# EAGLE design mega_shield3 (EAGLE 7.6.0)
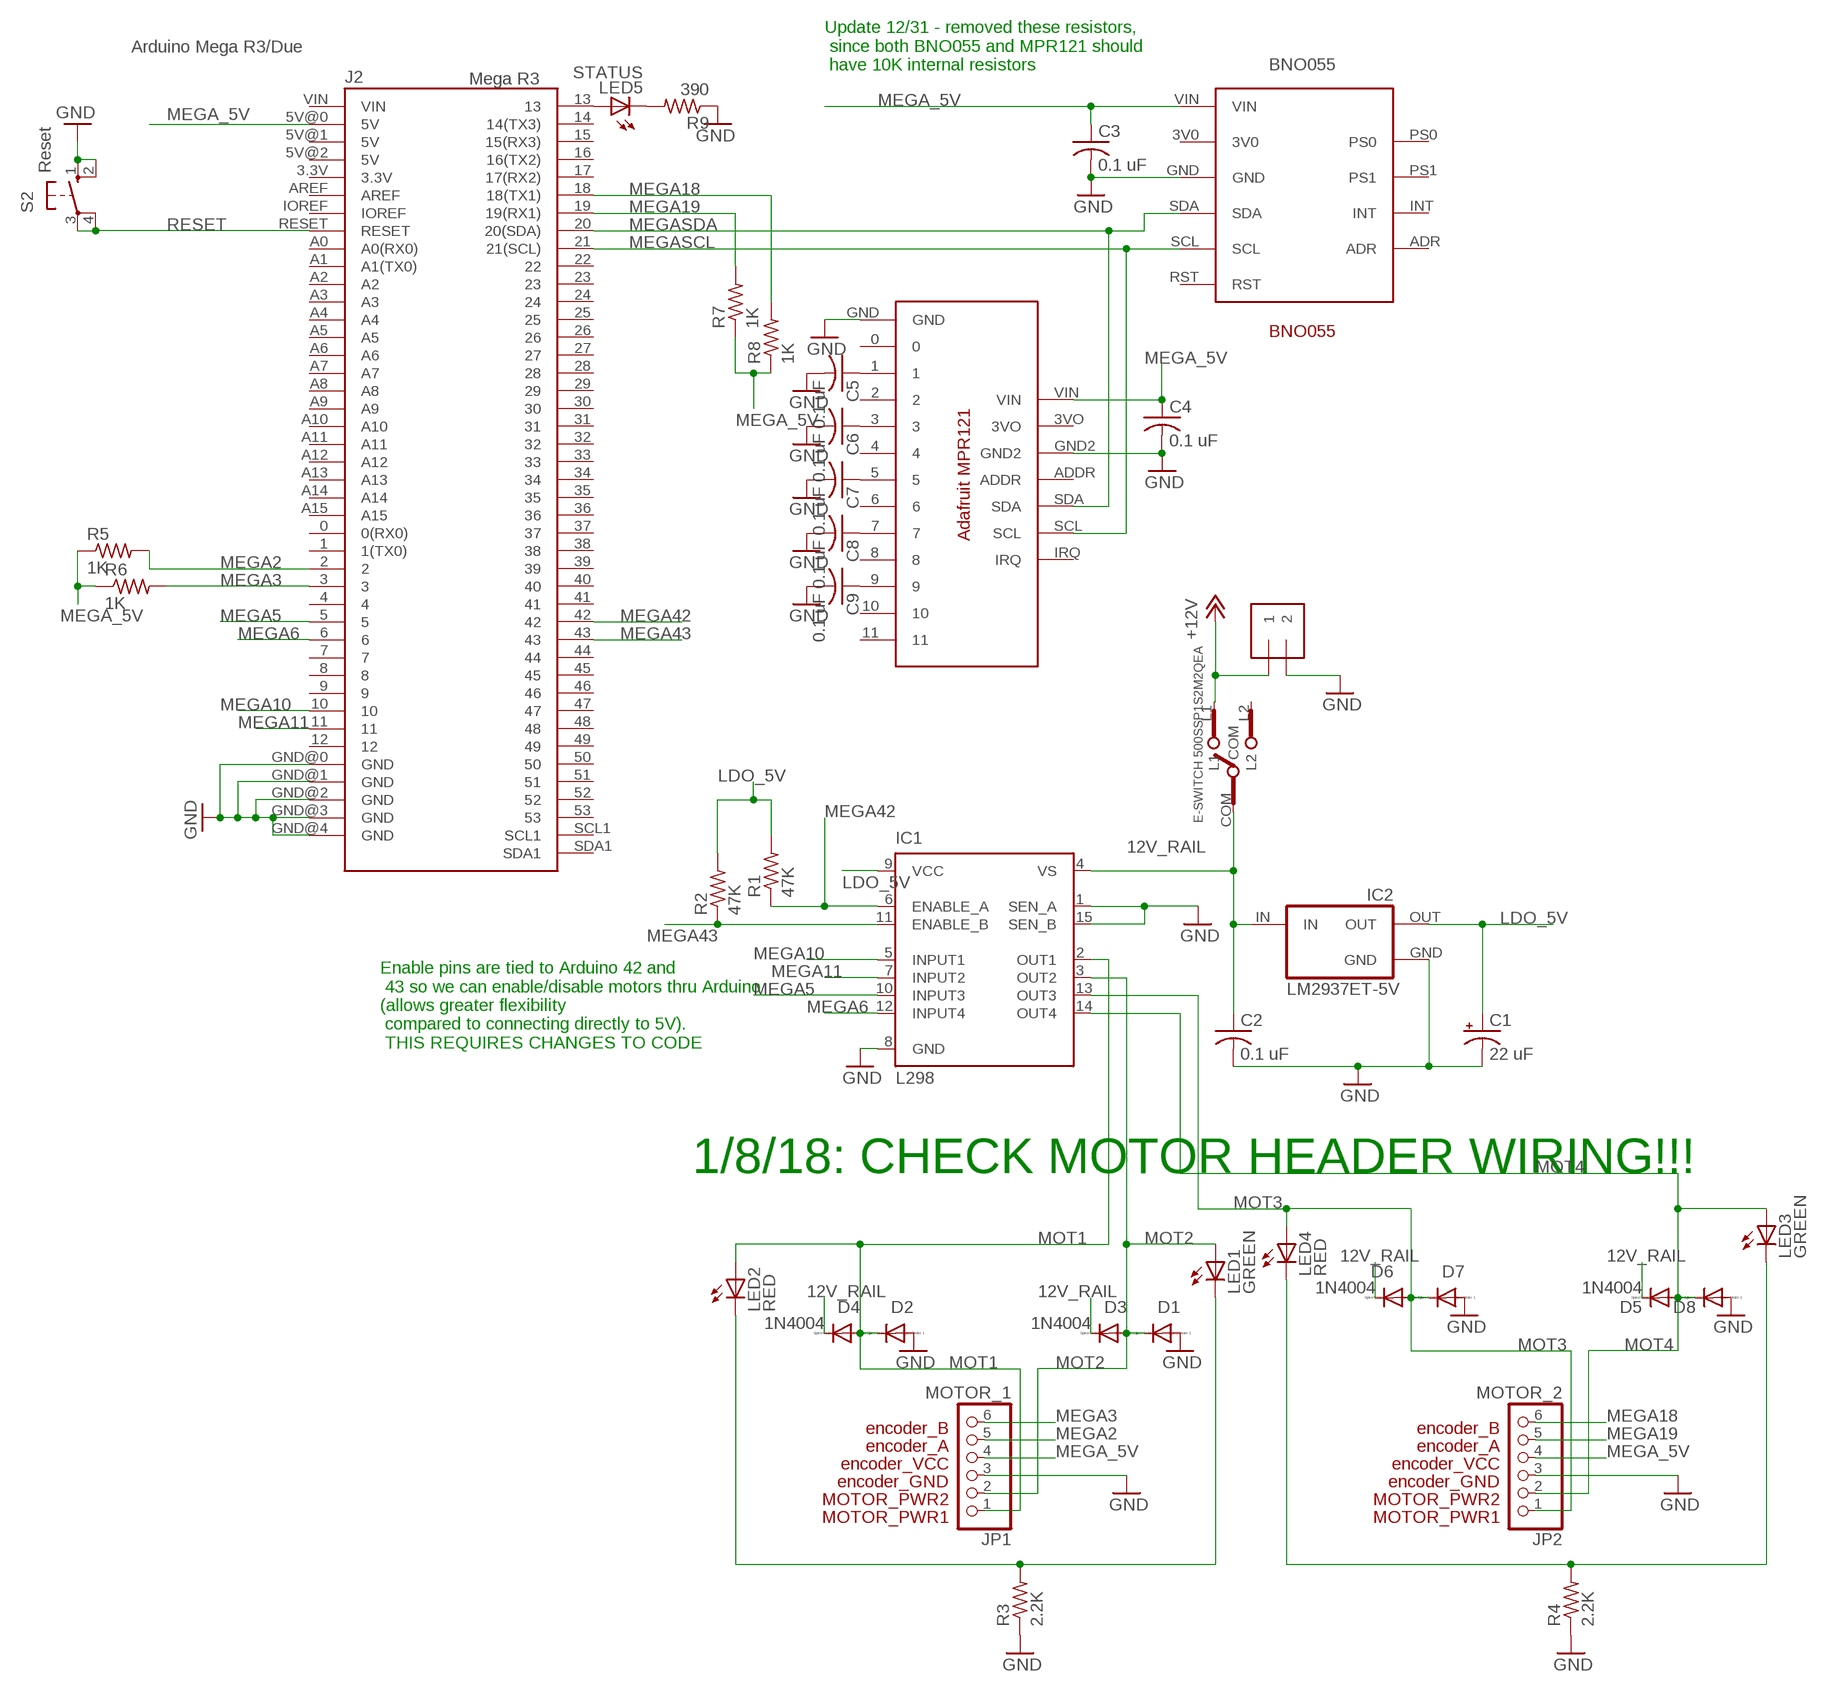
[diagram p0: schematic, sheet 1]

## Parts
12V_IN  1X2-3.5MM  [1X2-3.5MM]
BNO055  BNO055  [BNO055]
C1  22 uF  CPOL-USB45181A  [B45181A]
C2  0.1 uF  C-US025-050X050  [C025-050X050]
C3  0.1 uF  C-US025-050X050  [C025-050X050]
C4  0.1 uF  C-US025-050X050  [C025-050X050]
C5  0.1 uF  C-US025-050X050  [C025-050X050]
C6  0.1 uF  C-US025-050X050  [C025-050X050]
C7  0.1 uF  C-US025-050X050  [C025-050X050]
C8  0.1 uF  C-US025-050X050  [C025-050X050]
C9  0.1 uF  C-US025-050X050  [C025-050X050]
D1  1N4004  [DO41-10]
D2  1N4004  [DO41-10]
D3  1N4004  [DO41-10]
D4  1N4004  [DO41-10]
D5  1N4004  [DO41-10]
D6  1N4004  [DO41-10]
D7  1N4004  [DO41-10]
D8  1N4004  [DO41-10]
IC1  L298  [MULTIWATT-15]
IC2  LM2937ET-5V  LM2937ET-5,0  [TO220(V)]
J2  Mega R3  ARDUINO-MEGAFULL  [ARDUINO_MEGA]
JP1  MOTOR_1  PINHD-1X6  [1X06]
JP2  MOTOR_2  PINHD-1X6  [1X06]
LED1  GREEN  LED3MM  [LED3MM]
LED2  RED  LED3MM  [LED3MM]
LED3  GREEN  LED3MM  [LED3MM]
LED4  RED  LED3MM  [LED3MM]
LED5  STATUS  LED3MM  [LED3MM]
MPR121  ADA_MPR121  [ADA_MPR121]
R1  47K  R-US_0207/10  [0207/10]
R2  47K  R-US_0207/10  [0207/10]
R3  2.2K  R-US_0207/10  [0207/10]
R4  2.2K  R-US_0207/10  [0207/10]
R5  1K  R-US_0207/10  [0207/10]
R6  1K  R-US_0207/10  [0207/10]
R7  1K  R-US_0207/10  [0207/10]
R8  1K  R-US_0207/10  [0207/10]
R9  390  R-US_0207/10  [0207/10]
S2  Reset  10-XX  [B3F-10XX]
SLIDE_SW  E-SWITCH_500SSP1S2M2QEA  [E-SWITCH_500SSP1S2M2QEA]

## Nets
12V_RAIL [12V_PWR]: C2.1 D3.C D4.C D5.C D6.C IC1.4(VS) IC2.IN SLIDE_SW.COM
+12V [12V_PWR]: 12V_IN.1 SLIDE_SW.L1
GND: 12V_IN.2 BNO055.GND C1.- C2.2 C3.2 C4.2 C5.2 C6.2 C7.2 C8.2 C9.2 D1.A D2.A D7.A D8.A IC1.1(SEN_A) IC1.8(GND) IC1.15(SEN_B) IC2.GND J2.GND@0(GND) J2.GND@1(GND) J2.GND@2(GND) J2.GND@3(GND) J2.GND@4(GND) JP1.3 JP2.3 MPR121.GND MPR121.GND2 R3.1 R4.1 R9.1 S2.1(S) S2.2(S1)
LDO_5V [5V_LDO]: C1.+ IC1.9(VCC) IC2.OUT R1.2 R2.2
MEGA2: J2.2 JP1.5 R5.2
MEGA3: J2.3 JP1.6 R6.2
MEGA5: IC1.10(INPUT3) J2.5
MEGA6: IC1.12(INPUT4) J2.6
MEGA10: IC1.5(INPUT1) J2.10
MEGA11: IC1.7(INPUT2) J2.11
MEGA18: J2.18(18(TX1)) JP2.6 R8.2
MEGA19: J2.19(19(RX1)) JP2.5 R7.2
MEGA42: IC1.6(ENABLE_A) J2.42 R1.1
MEGA43: IC1.11(ENABLE_B) J2.43 R2.1
MEGA_5V [5V_LDO]: BNO055.VIN C3.1 C4.1 J2.5V@0(5V) JP1.4 JP2.4 MPR121.VIN R5.1 R6.1 R7.1 R8.1
MEGASCL: BNO055.SCL J2.21(21(SCL)) MPR121.SCL
MEGASDA: BNO055.SDA J2.20(20(SDA)) MPR121.SDA
MOT1 [12V_PWR]: D2.C D4.A IC1.2(OUT1) JP1.1 LED2.A
MOT2 [12V_PWR]: D1.C D3.A IC1.3(OUT2) JP1.2 LED1.A
MOT3 [12V_PWR]: D6.A D7.C IC1.13(OUT3) JP2.1 LED4.A
MOT4 [12V_PWR]: D5.A D8.C IC1.14(OUT4) JP2.2 LED3.A
N$1: C5.1 MPR121.1
N$2: C6.1 MPR121.3
N$3: J2.13 LED5.A
N$4: LED5.K(C) R9.2
N$5: C7.1 MPR121.5
N$6: C8.1 MPR121.7
N$7: LED1.K(C) LED2.K(C) R3.2
N$8: C9.1 MPR121.9
N$12: LED3.K(C) LED4.K(C) R4.2
RESET: J2.RESET S2.3(P) S2.4(P1)
Unconnected: BNO055.3V0 BNO055.ADR BNO055.INT BNO055.PS0 BNO055.PS1 BNO055.RST J2.0(0(RX0)) J2.1(1(TX0)) J2.3.3V J2.4 J2.5V@1(5V) J2.5V@2(5V) J2.7 J2.8 J2.9 J2.12 J2.14(14(TX3)) J2.15(15(RX3)) J2.16(16(TX2)) J2.17(17(RX2)) J2.22 J2.23 J2.24 J2.25 J2.26 J2.27 J2.28 J2.29 J2.30 J2.31 J2.32 J2.33 J2.34 J2.35 J2.36 J2.37 J2.38 J2.39 J2.40 J2.41 J2.44 J2.45 J2.46 J2.47 J2.48 J2.49 J2.50 J2.51 J2.52 J2.53 J2.A0(A0(RX0)) J2.A1(A1(TX0)) J2.A2 J2.A3 J2.A4 J2.A5 J2.A6 J2.A7 J2.A8 J2.A9 J2.A10 J2.A11 J2.A12 J2.A13 J2.A14 J2.A15 J2.AREF J2.IOREF J2.SCL1 J2.SDA1 J2.VIN MPR121.0 MPR121.2 MPR121.3VO MPR121.4 MPR121.6 MPR121.8 MPR121.10 MPR121.11 MPR121.ADDR MPR121.IRQ SLIDE_SW.L2

## Notes on the sheet
- Arduino Mega R3/Due
- Update 12/31 - removed these resistors,
   since both BNO055 and MPR121 should
   have 10K internal resistors
- Enable pins are tied to Arduino 42 and
   43 so we can enable/disable motors thru Arduino 
  (allows greater flexibility
   compared to connecting directly to 5V).
   THIS REQUIRES CHANGES TO CODE
- 1/8/18: CHECK MOTOR HEADER WIRING!!!

## Library data of the parts
12V_IN = adafruit:1X2: 3.5mm Terminal block http://www.ladyada.net/library/pcb/eaglelibrary.html
BNO055 = arduinoShield:BNO055
C1 = rcl:CPOL-US: POLARIZED CAPACITOR, American symbol
C2-C9 = rcl:C-US: CAPACITOR, American symbol
D1-D8 = diode:1N4004: DIODE general purpose rectifier, 1 A
IC1 = st-microelectronics:L298: DUAL FULL-BRIDGE DRIVER; MPN: L298N; OC_FARNELL: 1589425; OC_NEWARK: 32M1527
IC2 = lm2937:LM2937ET*: 400 and 500 mA Low Dropout Voltage Regulator NATIONAL SEMICONDUCTOR created by Peter.Hofmann@ph-tronic.de <mailto:Reter.Hofmann@ph-tronic.de> 10-2004 Rev.0
J2 = zortness:ARDUINO-MEGA: Arduino MegaR3 board footprint. Also works for Due.
JP1 JP2 = adafruit:PINHD-1X6: PIN HEADER
LED1-LED5 = adafruit:LED: LED OSRAM: - CHIPLED LG R971, LG N971, LY N971, LG Q971, LY Q971, LO R971, LY R971 LH N974, LH R974 LS Q976, LO Q976, LY Q976 LO Q996 - Hyper CHIPLED LW Q18S LB Q993, LB Q99A, LB R99A - SideLED LS A670, LO A670, LY A670, LG A670, LP A670 LB A673, LV A673, LT A673, LW A673 LH A674 LY A675 LS A676, LA A676, LO A676, LY A676, LW A676 LS A679, LY A679, LG A679 - Hyper Micro SIDELED® LS Y876, LA Y876, LO Y876, LY Y876 LT Y87S - SmartLED LW L88C, LW L88S LB L89C, LB L89S, LG L890 LS L89K, LO L89K, LY L89K LS L896, LA L896, LO L896, LY L896 - TOPLED LS T670, LO T670, LY T670, LG T670, LP T670 LSG T670, LSP T670, LSY T670, LOP T670, LYG T670 LG T671, LOG T671, LSG T671 LB T673, LV T673, LT T673, LW T673 LH T674 LS T676, LA T676, LO T676, LY T676, LB T676, LH T676, LSB T676, LW T676 LB T67C, LV T67C, LT T67C, LS T67K, LO T67K, LY T67K, LW E67C LS E67B, LA E67B, LO E67B, LY E67B, LB E67C, LV E67C, LT E67C LW T67C LS T679, LY T679, LG T679 LS T770, LO T770, LY T770, LG T770, LP T770 LB T773, LV T773, LT T773, LW T773 LH T774 LS E675, LA E675, LY E675, LS T675 LS T776, LA T776, LO T776, LY T776, LB T776 LHGB T686 LT T68C, LB T68C - Hyper Mini TOPLED® LB M676 - Mini TOPLED Santana® LG M470 LS M47K, LO M47K, LY M47K Source: http://www.osram.convergy.de/
MPR121 = arduinoShield:ADA_MPR121
R1-R9 = rcl:R-US_: RESISTOR, American symbol
S2 = switch-omron:10-XX: OMRON SWITCH; MPN: B3F-1000; OC_FARNELL: 176432; OC_NEWARK: 36M3542
SLIDE_SW = arduinoShield:E-SWITCH_500SSP1S2M2QEA

## Net classes
1 12V_PWR: width 2.159 mm
2 5V_LDO: width 0.305 mm

## Board
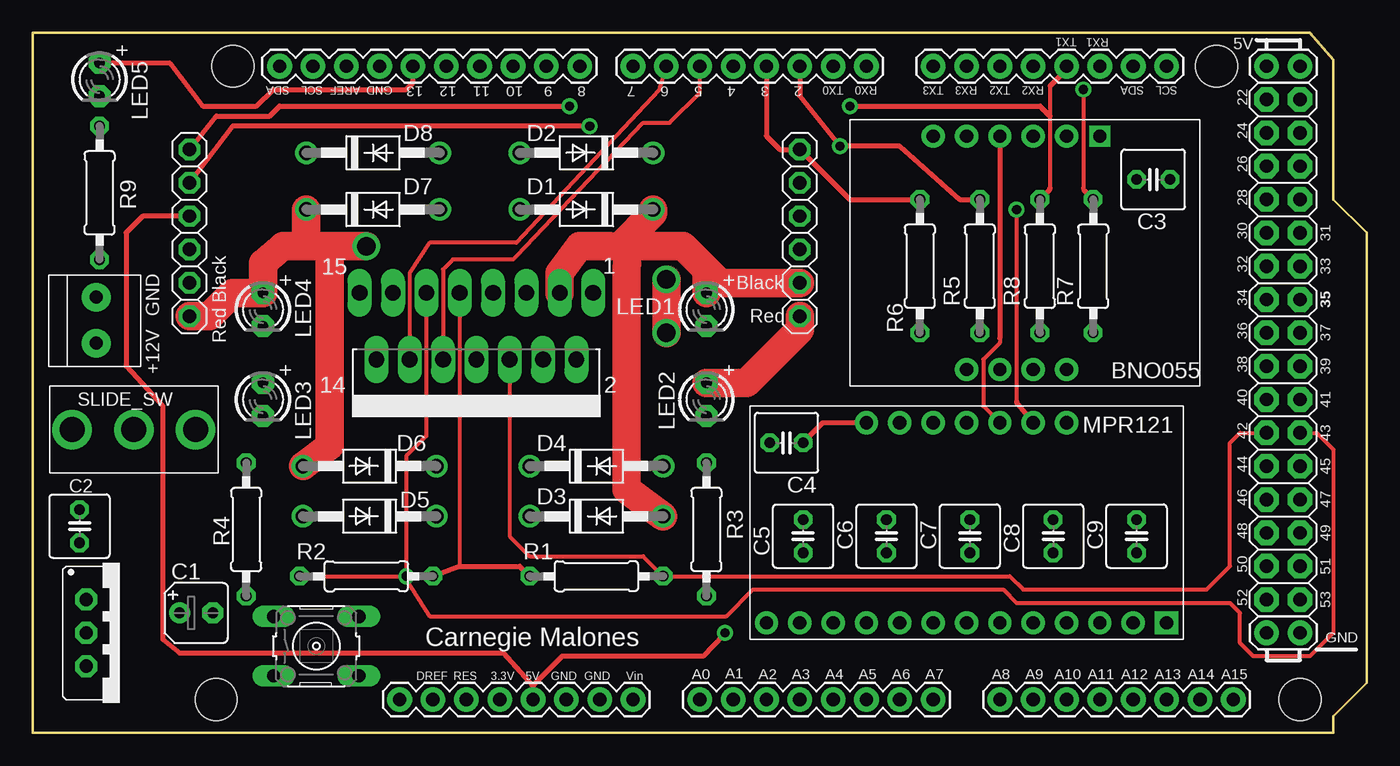
[diagram p1: board, top side]
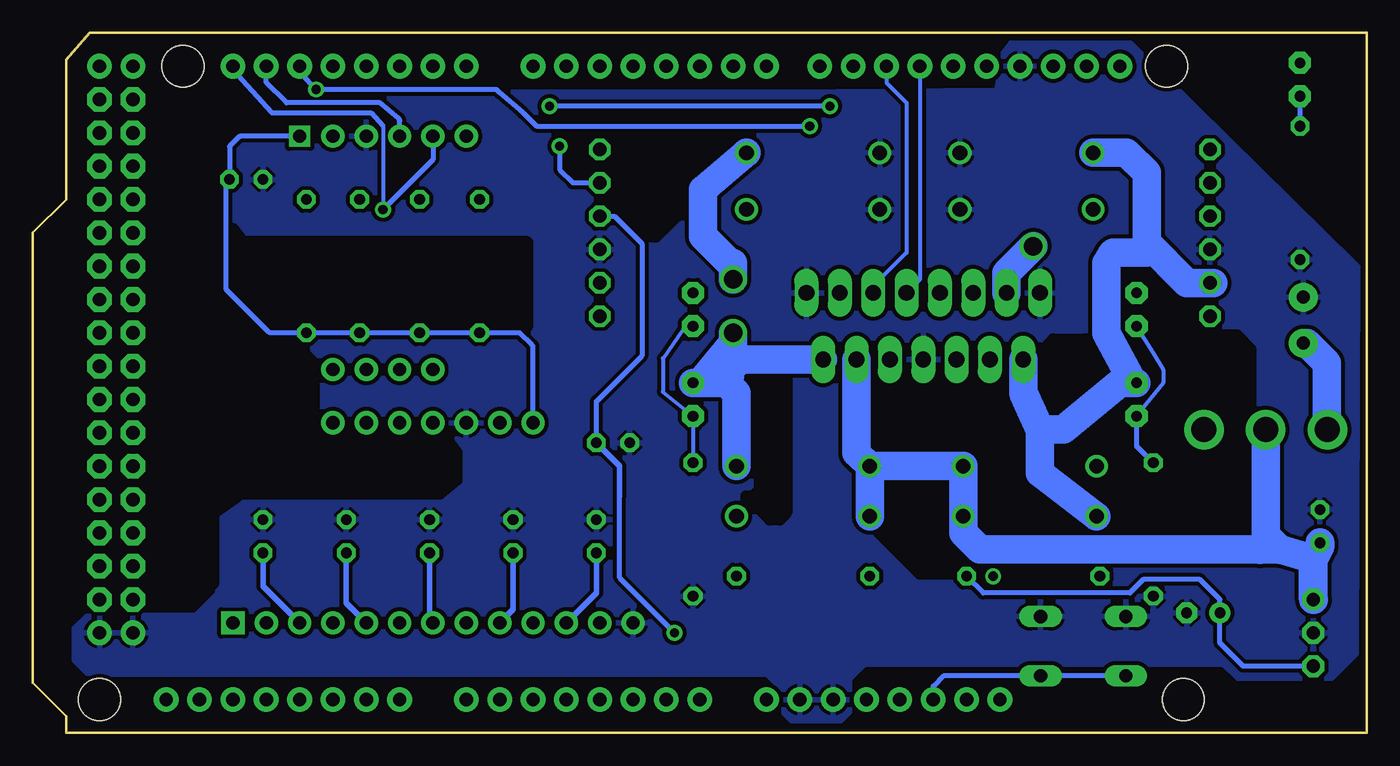
[diagram p2: board, bottom side, seen from below]

Size 101.6 x 53.34 mm. Coordinates in mm from the lower left corner, seen from the top.
Copper layers (1*16): Top 0.035mm / dielectric 1.5mm / Bottom 0.035mm
Design rules "SparkFun": minimum track width 8mil, minimum drill 20mil, track to track 8mil, track to pad 8mil, pad to pad 8mil, via to via 8mil, smd to smd 8mil, copper to edge 10mil, drill to drill 8mil, minimum pad ring 12mil, minimum via ring 10mil, stop-mask expansion 4mil, vias tented up to drill 25mil, thermal gap 10mil
bRestrict: area 44.2,16.3 to 47.2,26.9; area 26.2,15.7 to 37.3,26.2; area 30.7,12.2 to 37.1,18.8; area 64,31 to 86.4,38.4; area 48.5,37.9 to 56.5,45.7; area 69.3,18.3 to 92.5,33; area 9.1,15.5 to 15.7,22.4; area 8.9,22.4 to 15.5,30.7; area 86.1,9.9 to 92.7,19.6; area 87.6,33.5 to 92.5,49; 8 lines

### Footprints (pad centres in the part's own frame; a part is rotated, then mirrored left to right if it is on the bottom)
1X2-3.5MM = drill 1 pad 2.184: 1 1.8,0; 2 -1.7,0
BNO055 = drill 1.016 pad 1.778: 3V0 1.27,-10.16; ADR 19.05,-17.78; GND 1.27,-12.7; INT 19.05,-15.24; PS0 19.05,-10.16; PS1 19.05,-12.7; RST 1.27,-20.32; SCL 1.27,-17.78; SDA 1.27,-15.24 | drill 1.016 square: VIN 1.27,-7.62
B45181A = drill 0.813 pad 1.6: + -1.27,0 | drill 0.813 pad 1.6 octagon: - 1.27,0
C025-050X050 = drill 0.813 octagon: 1 -1.27,0; 2 1.27,0
DO41-10 = drill 1.118: A 5.08,0; C -5.08,0
MULTIWATT-15 = drill 1.2 long: 1 -8.89,-7.62; 2 -7.62,-2.54; 3 -6.35,-7.62; 4 -5.08,-2.54; 5 -3.81,-7.62; 6 -2.54,-2.54; 7 -1.27,-7.62; 8 0,-2.54; 9 1.27,-7.62; 10 2.54,-2.54; 11 3.81,-7.62; 12 5.08,-2.54; 13 6.35,-7.62; 14 7.62,-2.54; 15 8.89,-7.62
TO220(V) = drill 1.016 pad 1.676 octagon: GND 0,0; IN -2.54,0; OUT 2.54,0
ARDUINO_MEGA = drill 1.016 pad 1.88: 0 63.5,50.8; 1 60.96,50.8; 2 58.42,50.8; 3 55.88,50.8; 3.3V 35.56,2.54; 4 53.34,50.8; 5 50.8,50.8; 5V@0 38.1,2.54; 5V@1 93.98,50.8; 5V@2 96.52,50.8; 6 48.26,50.8; 7 45.72,50.8; 8 41.656,50.8; 9 39.116,50.8; 10 36.576,50.8; 11 34.036,50.8; 12 31.496,50.8; 13 28.956,50.8; 14 68.58,50.8; 15 71.12,50.8; 16 73.66,50.8; 17 76.2,50.8; 18 78.74,50.8; 19 81.28,50.8; 20 83.82,50.8; 21 86.36,50.8; A0 50.8,2.54; A1 53.34,2.54; A2 55.88,2.54; A3 58.42,2.54; A4 60.96,2.54; A5 63.5,2.54; A6 66.04,2.54; A7 68.58,2.54; A8 73.66,2.54; A9 76.2,2.54; A10 78.74,2.54; A11 81.28,2.54; A12 83.82,2.54; A13 86.36,2.54; A14 88.9,2.54; A15 91.44,2.54; AREF 23.876,50.8; EMPTY 27.94,2.54; GND@0 40.64,2.54; GND@1 43.18,2.54; GND@2 93.98,7.62; GND@3 96.52,7.62; GND@4 26.416,50.8; IOREF 30.48,2.54; RESET 33.02,2.54; SCL1 21.336,50.8; SDA1 18.796,50.8; VIN 45.72,2.54 | drill 1.016 pad 1.88 octagon: 22 93.98,48.26; 23 96.52,48.26; 24 93.98,45.72; 25 96.52,45.72; 26 93.98,43.18; 27 96.52,43.18; 28 93.98,40.64; 29 96.52,40.64; 30 93.98,38.1; 31 96.52,38.1; 32 93.98,35.56; 33 96.52,35.56; 34 93.98,33.02; 35 96.52,33.02; 36 93.98,30.48; 37 96.52,30.48; 38 93.98,27.94; 39 96.52,27.94; 40 93.98,25.4; 41 96.52,25.4; 42 93.98,22.86; 43 96.52,22.86; 44 93.98,20.32; 45 96.52,20.32; 46 93.98,17.78; 47 96.52,17.78; 48 93.98,15.24; 49 96.52,15.24; 50 93.98,12.7; 51 96.52,12.7; 52 93.98,10.16; 53 96.52,10.16 | hole 3.2: 15.24,50.8; 13.97,2.54; 90.17,50.8; 96.52,2.54
1X06 = drill 1.016 octagon: 1 -6.35,0; 2 -3.81,0; 3 -1.27,0; 4 1.27,0; 5 3.81,0; 6 6.35,0
LED3MM = drill 0.813 pad 1.676 octagon: A -1.27,0; K 1.27,0
ADA_MPR121 = drill 1.016 pad 1.778: 0 0,-2.54; 1 0,-5.08; 2 0,-7.62; 3 0,-10.16; 3VO 15.24,-10.16; 4 0,-12.7; 5 0,-15.24; 6 0,-17.78; 7 0,-20.32; 8 0,-22.86; 9 0,-25.4; 10 0,-27.94; ADDR 15.24,-15.24; GND 0,0; GND2 15.24,-12.7; IRQ 15.24,-22.86; SCL 15.24,-20.32; SDA 15.24,-17.78; VIN 15.24,-7.62 | drill 1.016 pad 1.778 square: 11 0,-30.48
0207/10 = drill 0.813 octagon: 1 -5.08,0; 2 5.08,0
B3F-10XX = drill 1.016 long: 1 -3.251,2.261; 2 3.251,2.261; 3 -3.251,-2.261; 4 3.251,-2.261
E-SWITCH_500SSP1S2M2QEA = drill 1.9 pad 3: COM 0.76,-2.61; L1 0.76,2.09; L2 0.76,-7.31

### Placement (x,y rotation side)
12V_IN  4.83,31.5 270 top
BNO055  88.9,46.74 270 top
C1  12.45,9.14 0 top
C2  3.56,15.75 90 top
C3  85.34,42.16 180 top
C4  57.4,22.1 180 top
C5  58.67,14.99 90 top
C6  65.02,14.99 90 top
C7  71.37,14.99 90 top
C8  77.72,14.99 90 top
C9  84.07,14.99 90 top
D1  42.16,39.88 180 top
D2  42.16,44.2 180 top
D3  42.93,16.51 0 top
D4  42.93,20.32 0 top
D5  25.65,16.51 180 top
D6  25.65,20.32 180 top
D7  25.91,39.88 0 top
D8  25.91,44.2 0 top
IC1  33.78,25.91 180 top
IC2  4.06,7.62 270 top
J2  0,0 0 top
JP1  58.42,38.1 90 top
JP2  11.94,38.1 90 top
LED1  51.31,32.26 270 top
LED2  51.31,25.4 270 top
LED3  17.53,25.4 270 top
LED4  17.53,32.26 270 top
LED5  5.08,49.78 270 top
MPR121  55.88,8.38 90 top
R1  42.93,11.94 180 top
R2  25.4,11.94 0 top
R3  51.31,15.49 90 top
R4  16.26,15.49 90 top
R5  72.14,35.56 90 top
R6  67.56,35.56 90 top
R7  80.77,35.56 90 top
R8  76.71,35.56 90 top
R9  5.08,41.15 90 top
S2  21.59,6.6 0 top
SLIDE_SW  5.08,22.35 90 top

### Tracks (layer width: path | path; a pad name or v marks a point on that pad's centre or on a via)
12V_RAIL
  Bottom 2.159: D6.C D5.C | D6.C D4.C | IC1.4 38.86,21.34 D4.C | D4.C D3.C | D6.C 30.73,15.24 29.46,13.97 8.13,13.97 | SLIDE_SW.COM 7.69,15.06 6.86,14.22
  Bottom 2.223: C2.1 3.56,14.22 4.06,13.21 | 4.06,13.21 6.6,13.97 | 6.6,13.97 8.13,13.97 | IC2.IN 4.06,13.21 | 6.86,14.22 6.6,13.97
+12V
  Bottom 2.159: 12V_IN.1 4.55,29.7 3.05,28.19 3.05,23.17 SLIDE_SW.L1
GND
  pour Bottom (isolate 0.305): 0.71,35.53 0.86,35.69 18.01,52.55 27.1,52.55 27.66,51.84 28.17,48.97 44.5,48.82 86.94,48.82 88.11,47.65 88.11,32.56 82.96,27.41 82.96,19 83.79,18.16 86.44,18.16 87.53,17.07 87.53,10.59 89.15,8.97 97.43,8.97 98.45,7.95 98.45,5.56 97.36,4.47 45.67,4.47 44.4,3.2 44.4,1.55 43.76,0.91 40.08,0.91 39.4,1.6 39.4,4.11 38.28,5.23 10.92,5.23 9.83,4.14 2.69,4.14 0.79,6.07 0.69,35.48
LDO_5V
  Top 0.305: IC1.9 32.51,12.7
  Top 0.381: R2.2 32.51,12.7 37.08,12.7 R1.2
  Bottom 0.381: R2.2 29.21,10.67 18.03,10.67 17.02,11.68 12.7,11.68 11.18,10.16 C1.+ 11.18,6.86 9.4,5.08 IC2.OUT
MEGA2  (via drill 0.7)
  Top 0.381: R5.2 70.61,40.64 66.04,44.7 v61.47,44.7 58.42,48.51 J2.2
  Bottom 0.381: v61.47,44.7 61.47,42.93 60.45,41.91 JP1.5
MEGA3
  Top 0.381: J2.3 55.88,45.47 56.9,44.45 JP1.6 62.23,40.64 R6.2
MEGA5
  Top 0.305: IC1.10 31.24,35.31 32,36.07 36.58,36.07 36.83,36.32 46.48,46.48 48.51,46.48 50.8,48.77 J2.5
MEGA6
  Top 0.305: IC1.12 28.7,35.05 30.23,37.34 36.83,37.34 47.75,49.02 J2.6
MEGA10
  Bottom 0.305: J2.10 36.58,49.53 35.05,48.01 35.05,36.58 37.59,34.04 IC1.5
MEGA11
  Bottom 0.305: J2.11 34.04,34.54 IC1.7
MEGA18  (via drill 0.7)
  Top 0.305: 77.47,49.28 77.47,46.99 77.47,41.51
  Top 0.381: J2.18 78.74,50.65 arc-45 78.67,50.47 77.47,49.28 | 77.47,41.51 arc-45 77.4,41.33 R8.2 | JP2.6 13.97,46.99 18.03,46.99 18.8,47.75 v40.89,47.75 | v62.23,47.75 76.71,47.75 77.47,46.99
  Bottom 0.381: v40.89,47.75 v62.23,47.75
MEGA19  (via drill 0.7)
  Top 0.305: 80.08,41.33 arc-45 80.01,41.51 v80.01,49.02
  Top 0.381: 80.08,41.33 R7.2 | JP2.5 15.24,46.23 v42.42,46.23
  Bottom 0.381: J2.19 81.21,50.73 81.21,50.22 v80.01,49.02 66.29,49.02 66.04,48.77 64.26,47.24 63.25,46.23 v42.42,46.23
MEGA42
  Top 0.305: IC1.6 36.32,14.99 37.85,13.46 46.48,13.46 R1.1 74.42,11.94 75.44,10.92 89.41,10.92 91.19,12.7 91.19,22.1 91.95,22.86 J2.42
MEGA43  (via drill 0.7)
  Top 0.305: IC1.11 29.97,22.61 28.45,21.08 v28.45,11.94 | R2.1 v28.45,11.94 | J2.43 97.79,22.86 99.06,21.59 99.06,7.62 97.28,5.84 92.96,5.84 91.95,6.86 91.95,9.14 91.19,9.91 74.93,9.91 73.91,10.92 54.86,10.92 52.83,8.89 30.23,8.89 28.45,11.68 v28.45,11.94
MEGA_5V  (via drill 0.7)
  Top 0.381: JP2.4 8.38,39.37 7.11,38.1 7.11,27.94 9.91,24.89 9.91,7.11 11.18,6.1 35.81,6.1 38.1,3.56 J2.5V@0 38.07,2.57 38.07,3.59 40.32,5.84 51.05,5.84 52.6,7.47 v52.73,7.62 | C4.1 58.67,22.13 60.18,23.63 63.49,23.63 MPR121.VIN
  Bottom 0.381: 86.87,41.66 86.87,33.78 83.64,30.55 arc-45 83.46,30.48 R7.1 R8.1 R5.1 R6.1 64.52,30.48 63.57,29.54 arc45 63.5,29.36 MPR121.VIN | 86.87,41.66 86.87,41.8 arc45 86.79,41.98 C3.1 | BNO055.VIN 85.75,45.47 arc-45 85.93,45.39 86.61,44.7 86.61,42.02 arc45 86.69,41.84 86.87,41.66 | 56.9,18.03 56.9,11.81 v52.73,7.62 | JP1.4 57.29,39.37 55.21,37.29 55.21,28.72 58.67,25.26 C4.1
  Bottom 0.406: C4.1 56.9,20.32 56.9,18.03
MEGASCL  (via drill 0.7)
  Top 0.305: v74.93,39.88 74.93,25.25
  Top 0.381: 74.93,25.25 arc45 75,25.07 MPR121.SCL
  Bottom 0.305: 74.93,46.23 v74.93,39.88
  Bottom 0.381: BNO055.SCL 71.12,43.69 v74.93,39.88 | J2.21 86.36,50.55 83.39,47.25 75.84,47.25 74.93,46.23
MEGASDA
  Top 0.305: 73.66,30.08 73.66,29.72 72.39,28.45 72.39,24.89 MPR121.SDA
  Top 0.381: BNO055.SDA 73.66,30.08
  Bottom 0.381: BNO055.SDA 73.66,46.63 arc-45 73.73,46.81 75.18,48.01 82.27,48.01 83.82,49.56 J2.20
MOT1  (via drill 1.4)
  Top 2.159: v48.26,34.54 v48.26,30.48 | JP1.1 58.42,30.73 54.36,26.67 LED2.A
  Bottom 2.159: 48.26,35.81 48.26,35.56 | 48.26,35.56 v48.26,34.54 | v48.26,30.48 48.26,29.72 50.8,26.67 | 50.8,26.67 LED2.A | 50.8,26.67 49.02,26.67 | 49.02,26.67 48.77,26.67 48.01,25.91 D4.A | IC1.2 47.75,28.45 49.02,27.18 48.51,27.18 49.02,26.67 | D2.C 50.55,41.4 50.55,37.85 48.26,35.56
MOT2
  Top 2.159: D3.A 45.21,18.54 45.21,35.31 45.34,36.96 | 45.34,36.96 44.67,37.02 | 44.67,37.02 43.94,37.08 41.66,37.08 40.13,35.05 IC1.3 | LED1.A 51.31,35.31 | 51.31,35.31 49.53,37.08 45.21,37.08 45.34,36.96 | D1.C 47.24,39.59 44.67,37.02 | JP1.2 52.32,34.29 51.31,35.31
MOT3  (via drill 1.4)
  Top 2.159: v25.4,37.08 22.61,37.08 | 22.61,37.08 22.61,21.84 D6.A | JP2.1 13.46,31.75 15.24,33.53 LED4.A 17.53,35.81 19.05,37.08 20.32,37.08 | 20.32,37.08 22.61,37.08 | D7.C 20.83,37.59 20.32,37.08
  Bottom 2.159: IC1.13 27.43,35.05 v25.4,37.08
MOT4
  Bottom 2.159: 17.78,26.67 19.81,30.48 19.81,35.81 19.43,36.45 19.3,36.58 16.76,36.58 16.76,37.34 | LED3.A 17.78,26.67 | 17.78,26.67 18.8,26.67 23.11,23.11 24.89,23.11 | 24.89,23.11 24.89,19.81 D5.A | IC1.14 26.16,25.91 24.89,23.11 | 11.68,34.29 JP2.2 13.72,34.29 16.76,37.34 | D8.C 18.29,44.2 16.76,42.67 16.76,37.34
N$1
  Bottom 0.406: C5.1 58.67,10.67 MPR121.1
N$2
  Bottom 0.406: C6.1 65.02,9.4 MPR121.3
N$3
  Top 0.381: LED5.A 10.41,51.05 12.95,47.75 17.02,47.75 18.29,49.02 28.45,49.02 28.96,49.53 J2.13
N$4
  Bottom 0.381: LED5.K R9.2
N$5
  Bottom 0.406: C7.1 71.37,8.64 MPR121.5
N$6
  Bottom 0.406: C8.1 77.72,9.91 MPR121.7
N$7
  Bottom 0.305: R3.2 LED2.K 53.61,25.99 53.61,28.53 52.07,30.73 LED1.K
N$8
  Bottom 0.406: C9.1 84.07,11.18 MPR121.9
N$12
  Bottom 0.305: LED4.K 16.26,28.96 15.49,27.69 15.49,26.67 LED3.K
  Bottom 0.381: LED3.K 17.53,21.84 R4.2
RESET
  Bottom 0.381: S2.3 S2.4 32.23,4.34 33.02,3.56 J2.RESET

### Text on the board
tNames: Black | Black | GND | +12V | Red | Red | Carnegie Malones